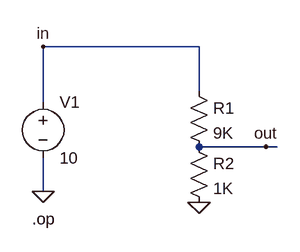
[diagram p0: schematic voltage_divider_circuit.asc]
voltage_divider_circuit.asc, the LTspice schematic file:
Version 4
SHEET 1 880 680
WIRE 240 -16 16 -16
WIRE 240 48 240 -16
WIRE 16 64 16 -16
WIRE 336 128 240 128
WIRE 352 128 336 128
WIRE 16 192 16 144
FLAG 16 192 0
FLAG 240 208 0
FLAG 16 -16 in
FLAG 336 128 out
SYMBOL voltage 16 48 R0
SYMATTR InstName V1
SYMATTR Value 10
SYMBOL res 224 32 R0
SYMATTR InstName R1
SYMATTR Value 9K
SYMBOL res 224 112 R0
SYMATTR InstName R2
SYMATTR Value 1K
TEXT 0 232 Left 2 !.op

The netlist it stands for:
* voltage_divider_circuit.asc
V1 in 0 10
R1 in out 9K
R2 out 0 1K
.op
.backanno
.end